# EAGLE schematic ac-motor-controller-mk-1.0 (EAGLE 6.5.0)
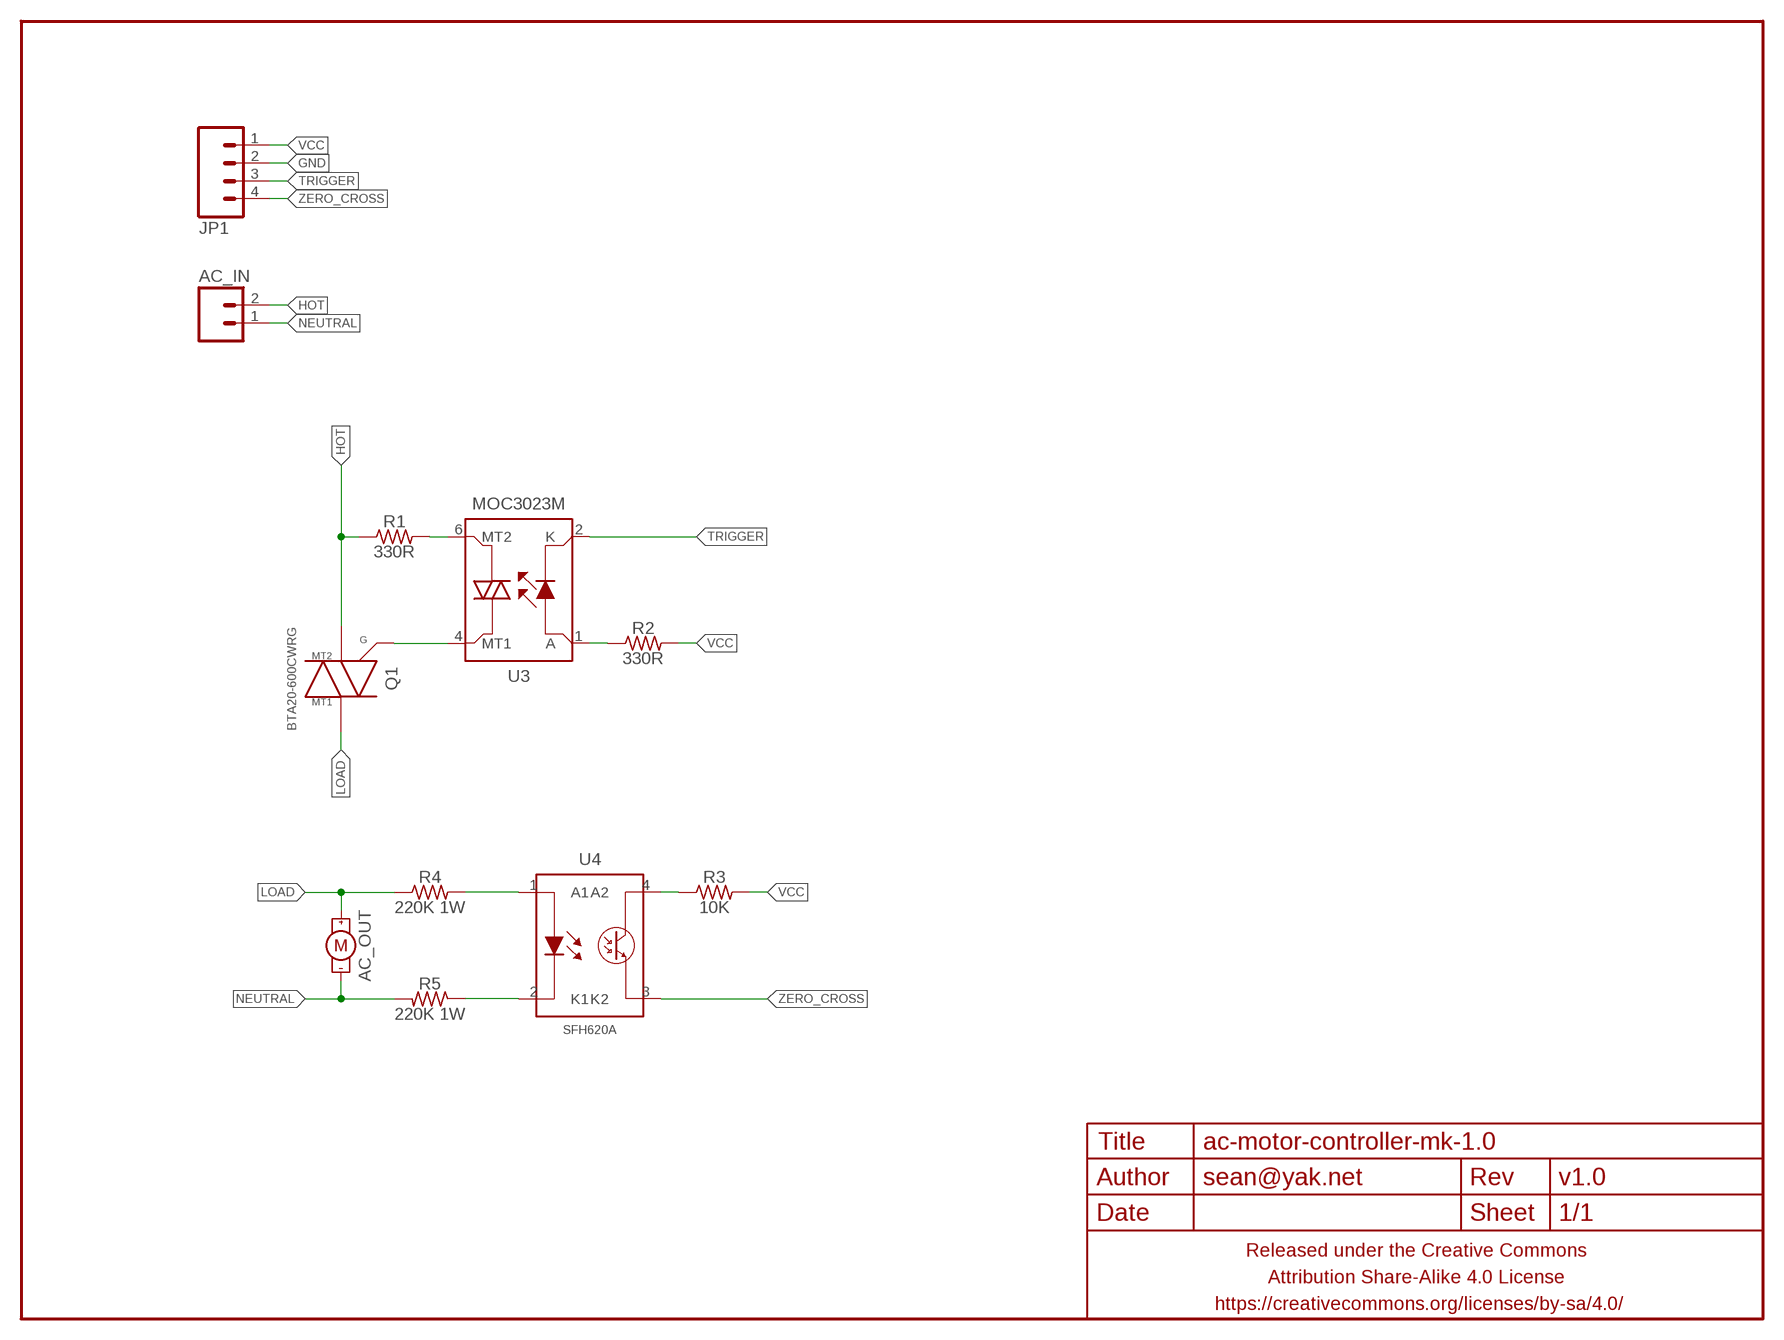
[diagram p0: schematic, sheet 1]

## Parts
AC_IN  SCREWTERMINAL-25MM  [SCREWTERM-5MM-2]
AC_OUT  MOTOR5MM-SCREW-TERM  [1X02_5MM_SCREW]
FRAME1  FRAME-LETTERNO_PACKAGE  [DUMMY]
JP1  M04JST-PTH-CENTERED  [JST-4-PH-VERT-PTH-CENTERED]
Q1  BTA20-600CWRG  TRIACTO-220-VERT  [TO220V]
R1  330R  RESISTORPTH-AXIAL-5.08MM  [RESISTOR-AXIAL-PTH-5.08MM]
R2  330R  RESISTORPTH-AXIAL-5.08MM  [RESISTOR-AXIAL-PTH-5.08MM]
R3  10K  RESISTORPTH-AXIAL-5.08MM  [RESISTOR-AXIAL-PTH-5.08MM]
R4  220K 1W  RESISTORPTH-AXIAL-10.16MM  [RESISTOR-AXIAL-PTH-10.16MM]
R5  220K 1W  RESISTORPTH-AXIAL-10.16MM  [RESISTOR-AXIAL-PTH-10.16MM]
U3  MOC3023M  MOC30XXMOC30XXM-DIP6  [DIP06]
U4  SFH620A  OPTOISOLATORDIP4  [DIL04]

## Nets
GND: JP1.2
HOT: AC_IN.2 Q1.2(MT2) R1.P$1
LOAD: AC_OUT.1(+) Q1.1(MT1) R4.P$1
N$1: R4.P$2 U4.1(A1)
N$2: R5.P$1 U4.2(K1)
N$3: R1.P$2 U3.6(MT2)
N$4: Q1.3(GATE) U3.4(MT1)
N$6: R2.P$1 U3.1(A)
N$8: R3.P$1 U4.4(A2)
NEUTRAL: AC_IN.1 AC_OUT.2(-) R5.P$2
TRIGGER: JP1.3 U3.2(K)
VCC: JP1.1 R2.P$2 R3.P$2
ZERO_CROSS: JP1.4 U4.3(K2)

## Library data of the parts
AC_IN = a_parts:SCREWTERMINAL-2
AC_OUT = a_parts:MOTOR: Brushed DC Motor Symbol for a motor combined with screw terminal output pads for hookup (since it's unlikely you're soldering the motor itself to a board :P).
FRAME1 = a_parts:FRAME-LETTER: Schematic Frame Standard 8.5x11 US Letter frame; DESIGNER: sean@yak.net; VERSION: v1.0
JP1 = a_parts:M04: Header 4 Standard 4-pin 0.1" header. Use with straight break away headers (SKU : PRT-00116), right angle break away headers (PRT-00553), swiss pins (PRT-00743), machine pins (PRT-00117), and female headers (PRT-00115). Molex polarized connector foot print use with SKU : PRT-08231 with associated crimp pins and housings. 1MM SMD Version SKU: PRT-10208
Q1 = a_parts:TRIAC
R1-R5 = a_parts:RESISTOR: RESISTOR, American symbol
U3 = a_parts:MOC30XX
U4 = a_parts:OPTOISOLATOR